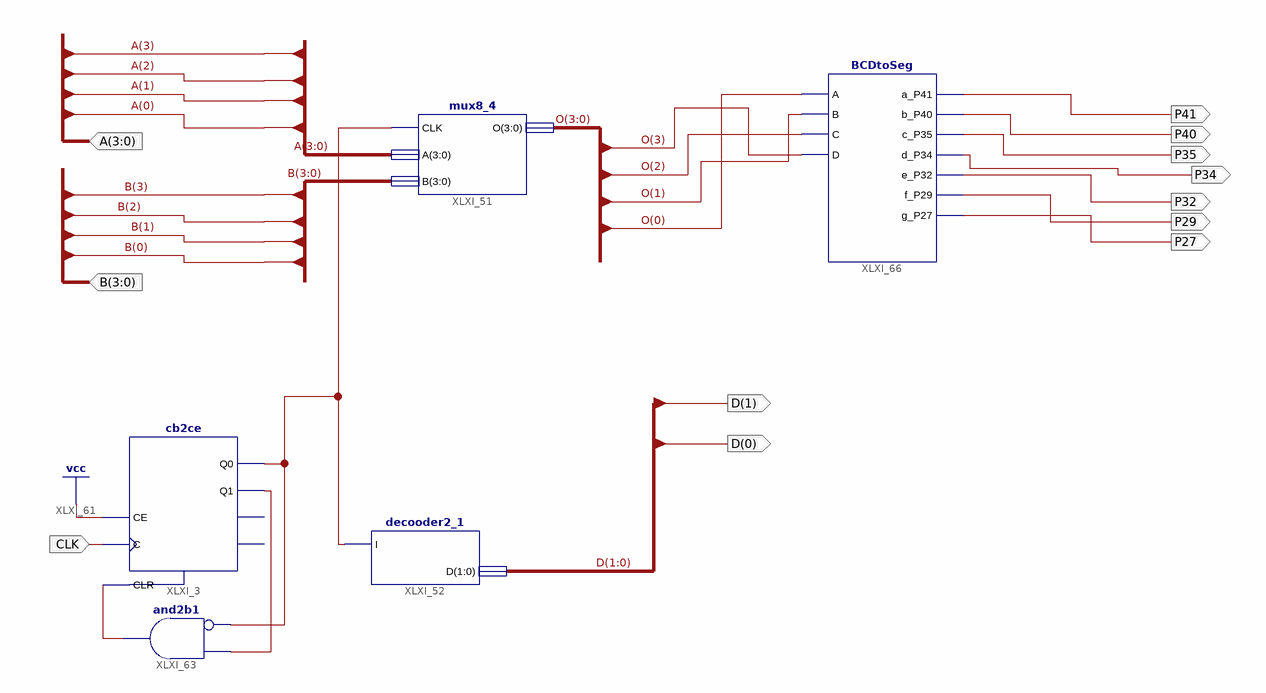
[diagram p0: schematic sheet 1]
// Xilinx ISE schematic Display.sch (spartan6) as structural Verilog: 5 symbols, 12 ports
module Display (
  input  [3:0] A,
  input  [3:0] B,
  input  CLK,
  output [1:0] D,
  output P41,
  output P35,
  output P34,
  output P32,
  output P27,
  output P40,
  output P29
);

  wire XLXN_24, XLXN_29, XLXN_30;
  wire [3:0] O;

  mux8_4 XLXI_51 (.CLK(XLXN_24), .A(A), .B(B), .O(O));
  decooder2_1 XLXI_52 (.I(XLXN_24), .D(D));
  cb2ce XLXI_3 (.C(CLK), .CE(1'b1), .CLR(XLXN_29), .Q0(XLXN_24), .Q1(XLXN_30));  // open: CEO, TC
  and XLXI_63 (XLXN_29, ~XLXN_24, XLXN_30);  // and2b1
  BCDtoSeg XLXI_66 (
    .A(O[0]), .B(O[1]), .C(O[2]), .D(O[3]), .g_P27(P27), .e_P32(P32), .c_P35(P35), .a_P41(P41), .d_P34(P34),
    .b_P40(P40), .f_P29(P29));
endmodule
